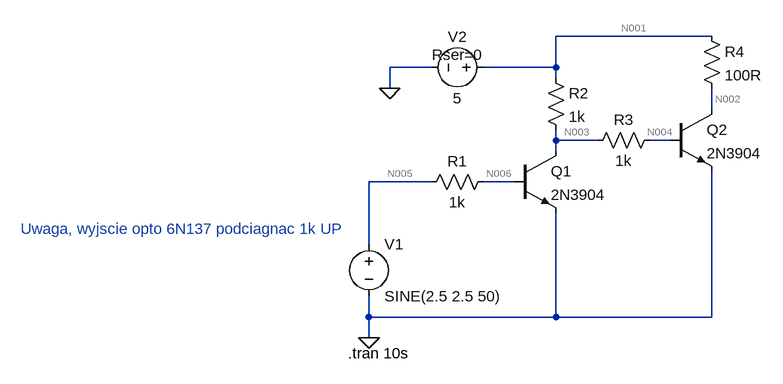
[diagram p0: schematic relay-driver.asc]
relay-driver.asc, the LTspice schematic file:
Version 4
SHEET 1 880 680
WIRE 672 -192 432 -192
WIRE 240 -144 176 -144
WIRE 432 -144 432 -192
WIRE 432 -144 320 -144
WIRE 432 -128 432 -144
WIRE 176 -112 176 -144
WIRE 672 -80 672 -112
WIRE 432 -32 432 -48
WIRE 496 -32 432 -32
WIRE 608 -32 576 -32
WIRE 432 -16 432 -32
WIRE 240 32 144 32
WIRE 368 32 320 32
WIRE 144 128 144 32
WIRE 144 240 144 208
WIRE 432 240 432 80
WIRE 432 240 144 240
WIRE 672 240 672 16
WIRE 672 240 432 240
WIRE 144 272 144 240
FLAG 144 272 0
FLAG 176 -112 0
SYMBOL voltage 144 112 R0
WINDOW 123 0 0 Left 2
WINDOW 39 0 0 Left 2
SYMATTR InstName V1
SYMATTR Value SINE(2.5 2.5 50)
SYMBOL npn 368 -16 R0
SYMATTR InstName Q1
SYMATTR Value 2N3904
SYMBOL res 336 16 R90
WINDOW 0 0 56 VBottom 2
WINDOW 3 32 56 VTop 2
SYMATTR InstName R1
SYMATTR Value 1k
SYMBOL res 416 -144 R0
SYMATTR InstName R2
SYMATTR Value 1k
SYMBOL voltage 336 -144 R90
WINDOW 0 -32 56 VBottom 2
WINDOW 3 32 56 VTop 2
WINDOW 123 0 0 Left 2
WINDOW 39 -4 56 VBottom 2
SYMATTR InstName V2
SYMATTR Value 5
SYMATTR SpiceLine Rser=0
SYMBOL res 592 -48 R90
WINDOW 0 0 56 VBottom 2
WINDOW 3 32 56 VTop 2
SYMATTR InstName R3
SYMATTR Value 1k
SYMBOL npn 608 -80 R0
SYMATTR InstName Q2
SYMATTR Value 2N3904
SYMBOL res 656 -208 R0
SYMATTR InstName R4
SYMATTR Value 100R
TEXT 112 296 Left 2 !.tran 10s
TEXT -392 104 Left 2 ;Uwaga, wyjscie opto 6N137 podciagnac 1k UP

The netlist it stands for:
* relay-driver.asc
V1 N005 0 SINE(2.5 2.5 50)
Q1 N003 N006 0 0 2N3904
R1 N006 N005 1k
R2 N001 N003 1k
V2 N001 0 5 Rser=0
R3 N004 N003 1k
Q2 N002 N004 0 0 2N3904
R4 N001 N002 100R
.model NPN NPN
.model PNP PNP
.lib standard.bjt
.tran 10s
* Uwaga, wyjscie opto 6N137 podciagnac 1k UP
.backanno
.end

* Results of the author's LTspice run, read from the files saved beside the schematic
* Operating Point, zero values left out:
*   V(n005) = 2.5 V
*   V(n003) = 19.41 mV
*   V(n006) = 758.4 mV
*   V(n001) = 5 V
*   V(n004) = 19.41 mV
*   V(n002) = 5 V
*   Ic(Q2) = 5.009 pA
*   Ib(Q2) = -4.964 pA
*   Ic(Q1) = 4.981 mA
*   Ib(Q1) = 1.742 mA
*   Ie(Q1) = -6.722 mA
*   I(R4) = 5 pA
*   I(R3) = 4.964 pA
*   I(R2) = 4.981 mA
*   I(R1) = -1.742 mA
*   I(V2) = -4.981 mA
*   I(V1) = -1.742 mA
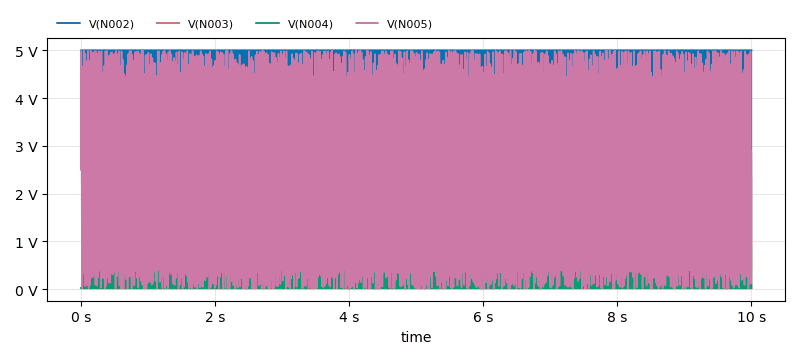
[diagram p1: Transient Analysis of relay-driver.asc, plotted from the saved traces]
* Transient Analysis, 1 run:
*   V(N002): min 66.57 mV, max 5.001 V, average 3.791 V, rms 4.344 V, last 5 V
*   V(N003): min 13.47 mV, max 2.905 V, average 714.9 mV, rms 1.412 V, last 19.41 mV
*   V(N004): min 13.47 mV, max 810.7 mV, average 216.7 mV, rms 402 mV, last 19.32 mV
*   V(N005): min 5.969 mV, max 4.994 V, average 2.481 V, rms 3.041 V, last 2.5 V